# Altium schematic sheet BoardA-LEDDriver.SchDoc
size A; SheetNumber: 3; SheetTotal: 3
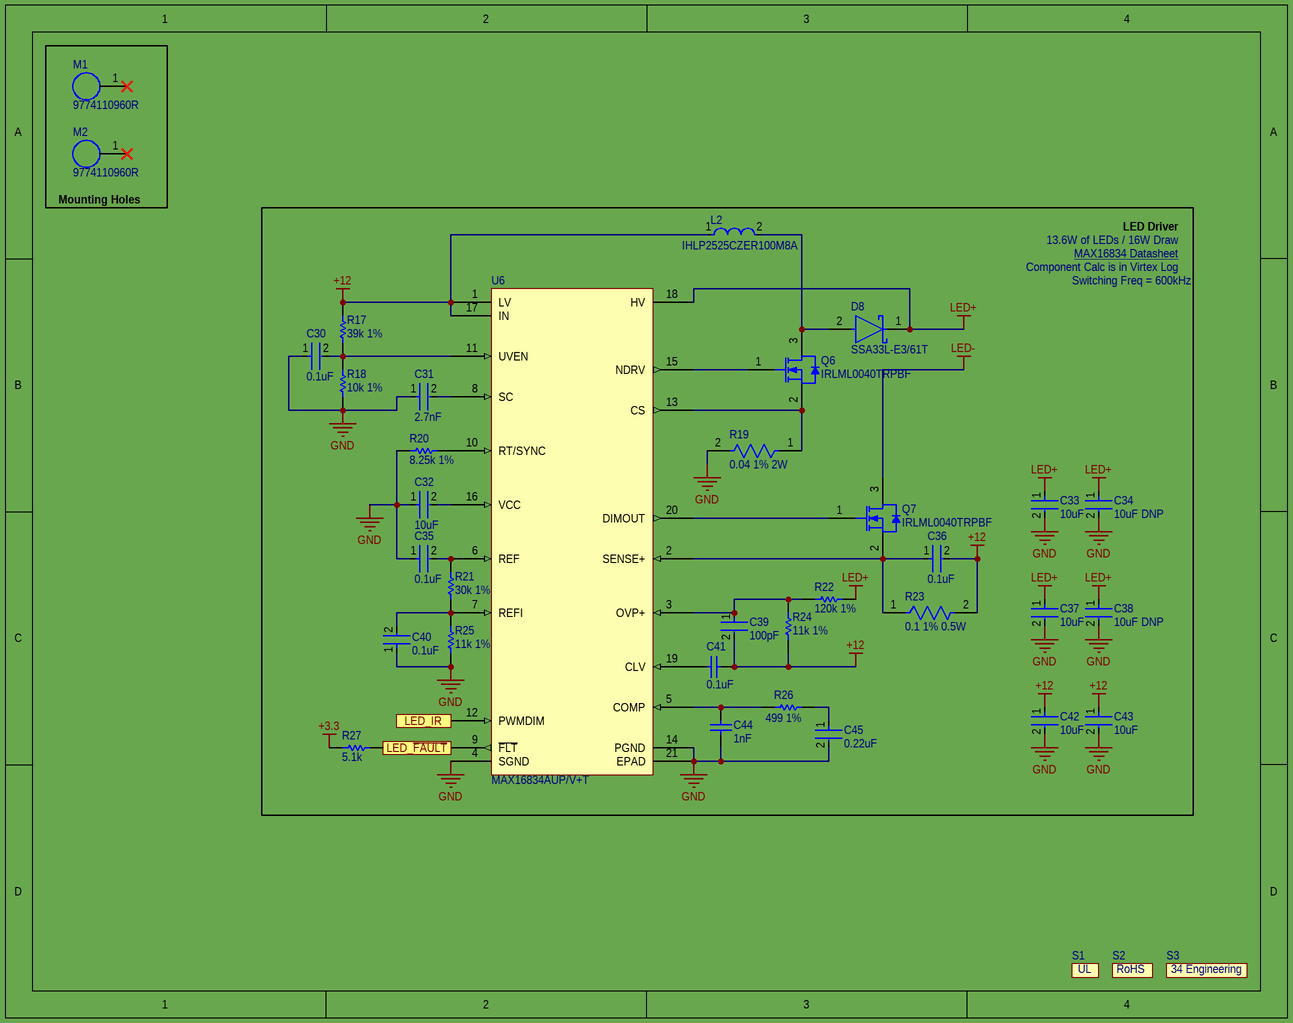
[diagram p0: BoardA-LEDDriver.SchDoc]

## Parts
C30  0.1uF  [FP-CGA3E-0_3-0_1-IPC_A]
C31  2.7nF  [FP-GCM188-0_1-MFG]
C32  10uF  [FP-GRM188-0_2-IPC_C]
C33  10uF  [FP-GRM188-0_2-IPC_C]
C34  10uF DNP  [FP-GRM188-0_2-IPC_C]
C35  0.1uF  [FP-CGA3E-0_3-0_1-IPC_A]
C36  0.1uF  [FP-CGA3E-0_3-0_1-IPC_A]
C37  10uF  [FP-GRM188-0_2-IPC_C]
C38  10uF DNP  [FP-GRM188-0_2-IPC_C]
C39  100pF  [FP-C0402-BB-MFG]
C40  0.1uF  [FP-CGA3E-0_3-0_1-IPC_A]
C41  0.1uF  [CAPC2013X135X45LL10T25]
C42  10uF  [FP-GRM188-0_2-IPC_C]
C43  10uF  [FP-GRM188-0_2-IPC_C]
C44  1nF  [CAPC1608X90X35NL10T15]
C45  0.22uF  [FP-GRM188-0_1-e0_2_0_5-IPC_C]
D8  SSA33L-E3/61T  [FP-SSA33L-E3-61T-MFG]
L2  IHLP2525CZER100M8A  [FP-IHLP-2525CZ-FP_2_413x3-MFG]
M1  9774110960R  [9774110960R]
M2  9774110960R  [9774110960R]
Q6  IRLML0040TRPBF  [INTR-SOT23-3_V]
Q7  IRLML0040TRPBF  [INTR-SOT23-3_V]
R17  39k 1%  [RESC1608X55X30NL15T15]
R18  10k 1%  [RESC1609X55X30LL15T15]
R19  0.04 1% 2W  [FP-CSRN2512-IPC_C]
R20  8.25k 1%  [RESC1608X55X30LL15T15]
R21  30k 1%  [RESC1608X55X30NL15T15]
R22  120k 1%  [RESC1609X55X30LL15T15]
R23  0.1 1% 0.5W  [FP-CSR1206-IPC_C]
R24  11k 1%  [RESC1608X55X30LL15T15]
R25  11k 1%  [RESC1608X55X30LL15T15]
R26  499 1%  [RESC1608X55X30NL15T15]
R27  5.1k  [RESC1005X40X25NL05T10]
S1  (no value)  [UL]
S2  (no value)  [RoHS]
S3  (no value)  [34EngineeringLogo]
U6  MAX16834AUP/V+T  [MAX16834AUPV+T]

## Blocks framed on the sheet
Mounting Holes: M1 M2

## Ports
LED_IR (in), LED_~{FAULT} (out)

## Nets
+3.3: R27.1
+12: C36.2 C39.2 C41.2 C42.1 C43.1 L2.1 R17.2 R23.2 R24.1 U6.1(LV) U6.17(IN)
GND: C30.1 C31.1 C32.1 C33.2 C34.2 C35.1 C37.2 C38.2 C40.1 C42.2 C43.2 C44.1 C45.2 R18.1 R19.2 R20.1 R25.2 U6.4(SGND) U6.14(PGND) U6.21(EPAD)
LED+: C33.1 C34.1 C37.1 C38.1 D8.1(C) R22.2 U6.18(HV)
LED-: Q7.3(D)
LED_~{FAULT}: R27.2 U6.9(~{FLT}) ; port LED_~{FAULT}
LED_IR: U6.12(PWMDIM) ; port LED_IR
NetC30_2: C30.2 R17.1 R18.2 U6.11(UVEN)
NetC31_2: C31.2 U6.8(SC)
NetC32_2: C32.2 U6.16(VCC)
NetC35_2: C35.2 R21.2 U6.6(REF)
NetC36_1: C36.1 Q7.2(S) R23.1 U6.2(SENSE+)
NetC39_1: C39.1 R22.1 R24.2 U6.3(OVP+)
NetC40_2: C40.2 R21.1 R25.1 U6.7(REFI)
NetC41_1: C41.1 U6.19(CLV)
NetC44_2: C44.2 R26.1 U6.5(COMP)
NetC45_1: C45.1 R26.2
NetD8_2: D8.2(A) L2.2 Q6.3(D)
NetQ6_1: Q6.1(G) U6.15(NDRV)
NetQ6_2: Q6.2(S) R19.1 U6.13(CS)
NetQ7_1: Q7.1(G) U6.20(DIMOUT)
NetR20_2: R20.2 U6.10(RT/SYNC)

Not connected (* = marked no-connect by the designer): M1 1*; M2 1*

## Notes on the sheet
- LED Driver
- Switching Freq = 600kHz
- 13.6W of LEDs / 16W Draw
- MAX16834 Datasheet <https://datasheets.maximintegrated.com/en/ds/MAX16834.pdf>
- Component Calc is in Virtex Log
- (in symbol 34EngineeringLogo) 34 Engineering

## Library data of the parts
C30 C35 C36 C40 = CMP-2000-07546-2: Cap Ceramic 100nF 50V X7R 10% Pad SMD 0603 +125°C Automotive T/R; Weight: 7.1E-05oz; Composition: Ceramic; Max Operating Temperature: 125°C; Termination: SMD/SMT; Dielectric: X7R; Length: 1.6mm; Package Quantity: 1; REACH SVHC: No SVHC; Lead Free: Lead Free; Case Code (Metric): 1608; Min Operating Temperature: -55°C; Packaging: Tape and Reel; Tolerance: 10%; Voltage Rating: 50V; Case Code (Imperial): 0603; Capacitance: 100nF; Case/Package: 0603; Voltage Rating (DC): 50V; Depth: 0.8mm; Radiation Hardening: No; Ratings: AEC-Q200; Mount: Surface Mount; Voltage: 50V; Thickness: 0.035inch; Width: 0.8mm; Height: 0.8mm
C31 = CMP-2006-02319-2: Ceramic Capacitor for Automotive 2.7nF  ±5% 50VDC C0G 0603 Paper T/R; Voltage Rating: 50V; Length: 1.6mm; Radiation Hardening: No; Package Quantity: 4000; Ratings: AEC-Q200; Packaging: Tape and Reel; Capacitance: 2.7nF; Termination: SMD/SMT; Case Code (Metric): 1608; Case/Package: 0603; Dielectric: C0G; Tolerance: 5%; Max Operating Temperature: 125°C; Min Operating Temperature: -55°C; Mount: Surface Mount; Width: 0.031inch; Case Code (Imperial): 0603; Voltage Rating (DC): 50V; Depth: 0.8mm; Height: 0.8mm; Thickness: 0.035inch
C32-C34 C37 C38 C42 C43 = CMP-2006-02814-2: Chip Multilayer Ceramic Capacitors for General Purpose, 0603, 10uF, X5R, 15%, 20%, 16V; Width: 0.031inch; Case/Package: 0603; Mount: Surface Mount; Capacitance: 10uF; Depth: 0.8mm; REACH SVHC: No SVHC; Lead Free: Lead Free; Tolerance: 20%; Case Code (Imperial): 0603; Voltage Rating: 16V; Height: 0.8mm; Case Code (Metric): 1608; Thickness: 0.031inch; Voltage: 16V; Voltage Rating (DC): 16V; Length: 1.6mm; Max Operating Temperature: 85°C; Dielectric: X5R; Min Operating Temperature: -55°C; Packaging: Tape and Reel; Package Quantity: 4000
C39 = CMP-2008-03301-2: CAP CER 100PF 100V NP0 0402; Manufacturer: Kemet; Manufacturer Part Number: C0402C101J1GACTU; Material: Ceramic; Tolerance: 0.05; Temperature Coefficient: 15%; Temperature Characteristic: C0G; Device Class L3: Ceramic Capacitors; Category: Cap; Ipc Land Pattern Name: CAPC10050X50; Lead Free: Yes; Height: 0.55mm; Temperature Range Low: -55°C; ComponentLink2Description: Datasheet; Value: 100 pF; Temperature: -55°C to +125°C; Digikey Description: CAP CER 100PF 100V NP0 0402; Voltage Rating: 100 V; ComponentLink2URL: https://content.kemet.com/datasheets/KEM_C1002_X7R_SMD.pdf; Octopart: https://octopart.com/c0402c101j1gactu-kemet-12592160; Device Class L2: Capacitors; RoHS: TRUE; Mouser Description: Cap Ceramic 100pF 100V C0G 5% SMD 0402 125°C Paper T/R; Package: C0402-BB; Automotive: No; Device Class L1: Passive Components; Capacitance: 100 pF; Temperature Range High: +125°C
C41 = CMP-2100-03644-1: Chip Capacitor, 0.1 uF, +/- 10%, 50 V, -55 to 125 degC, 0805 (2012 Metric), RoHS, Tape and Reel; Manufacturer: Murata; Voltage: 50V; Capacitance: 100nF; Insulation Resistance: 10GR; Dielectric Material: Ceramic; Dielectric: X7R; Package Description: 2-Pin Surface Mount Device, Body 2 x 1.25 mm; Manufacturer URL: http://www.murata.com/; Case Code (Imperial): 0805; Datasheet URL: http://psearch.en.murata.com/capacitor/product/GRM21BR71H104KA01%23.pdf; Termination: SMD/SMT; Lead Free: LeadFree; Package Quantity: 1; Mount: SurfaceMount; REACH SVHC: Unknown; Thickness: 0.053inch; Height: 1.25mm; Case/Package: 0805; Voltage Rating: 50V; Width: 0.049inch; Case Code (Metric): 2012; Material: Ceramic; Min Operating Temperature: -55degC; RoHSCompliant: true; Datasheet Version: 42675.0; Voltage Rating (DC): 50V; Tolerance: 10%; Package Reference: 0805; Depth: 1.25mm; Length: 2mm; Max Operating Temperature: 125degC; Packaging: TapeandReel; Number of Pins: 2; Radiation Hardening: No
C44 = CMP-2006-02891-1: Part Number: GRM188R71H102KA01D; Manufacturer: Murata
C45 = CMP-1035-02648-3: Chip Multilayer Ceramic Capacitors for General Purpose, 0603, 0.22uF, X7R, 15%, 10%, 25V; Voltage: 50V; Capacitance: 220nF; Number of Pins: 2; Length: 1.6mm; Material: Ceramic; Depth: 0.8mm; REACH SVHC: No SVHC; Voltage Rating (DC): 25V; Tolerance: 10%; Max Operating Temperature: 125°C; Lead Free: Lead Free; Package Quantity: 1; Voltage Rating: 25V; Width: 0.8mm; Case Code (Metric): 1608; Min Operating Temperature: -55°C; Case/Package: 0603; Mount: Surface Mount; Dielectric: X7R; Height: 0.8mm; Termination: SMD/SMT; Radiation Hardening: No; Case Code (Imperial): 0603; Thickness: 0.035inch; Packaging: Tape and Reel
D8 = CMP-02539-000032-1: DIODE SCHOTTKY 30V 3A DO214AC; Manufacturer: Vishay; Standoff Height: 0mm; Peak Reverse Current: 0.5mA; Max Surge Forward Current: 75A; Max Junction Temp: +150°C; Package: DO-214AC; Forward Current: 3A; Digikey Description: DIODE SCHOTTKY 30V 3A DO214AC; Reverse Voltage: 30V; Automotive: No; Max Repetitive Reverse Voltage: 30V; Temperature: -65°C to +150°C; Device Class L3: Schottky Diodes; Device Class L2: Diodes; ComponentLink2Description: Datasheet; Mouser Description: Schottky Diodes & Rectifiers 3.0 Amp 30 Volt; Height: 2.29mm; Manufacturer Part Number: SSA33L-E3/61T; Device Class L1: Discrete Semiconductors; Lead Free: Yes; Temperature Range High: +150°C; ComponentLink2URL: http://www.vishay.com/docs/88883/ssa33l.pdf; Category: Diode; RoHS: TRUE; Temperature Range Low: -65°C; Octopart: https://octopart.com/ssa33l-e3%2F61t-vishay-39552932
L2 = CMP-02424-000640-1: Automotive Inductors, High Temperature (180 °C) Series 10uH 4A 76.9mΩ 20%; DC Resistance (DCR): 76.9mR; Self Resonant Frequency: 13.9MHz; Saturation Current: 2.9A; Shielding: Shielded; Test Frequency: 100kHz; Tolerance: 20%; Max DC Current: 4A; Mount: Surface Mount; Inductance Tolerance: 20%; Length: 0.27inch; RMS Current (Irms): 4A; Case Code (Metric): 6363; Ratings: AEC-Q200; Package Quantity: 2000; Width: 0.255inch; Height: 3mm; Max Operating Temperature: 180°C; Current Rating: 4A; Case/Package: Nonstandard; Termination: SMD/SMT; Case Code (Imperial): 2525; Height - Seated (Max): 0.118inch; Inductance: 10uH; Depth: 6.47mm; Packaging: Tape and Reel; Min Operating Temperature: -55°C
M1 M2 = 9774110960R: WURTH ELEKTRONIK         9774110960R             Spacer, SMT, Swage Round, Steel, 6x11mm; Manufacturer: Wurth Electronics; Manufacturer Part Number: 9774070960R; Plating: Tin; Threaded/Unthreaded: Unthreaded; Inside Diameter: 0.13inch; Outside Diameter: 0.236inch; RoHS: Yes; Category: Spacers, Standoffs; Stock 1: 8947; Pricing 1: 1=1.73000, 10=1.65800, 50=1.45600, 100=1.35500 (USD); Material: Steel; Length: 0.33inch; REACH SVHC: Unknown; ComponentLink1URL: http://www.mouser.com/ds/2/445/9774070960R-611130.pdf?src-supplier=Mouser; ComponentLink1Description: http://www.mouser.com/ds/2/445/9774070960R-611130.pdf?src-supplier=Mouser; ComponentLink2URL: http://www.farnell.com/datasheets/1960400.pdf?src-supplier=Farnell; ComponentLink2Description: http://www.farnell.com/datasheets/1960400.pdf?src-supplier=Farnell; ComponentLink3URL: https://media.digikey.com/pdf/Data%20Sheets/Wurth%20Electronics%20PDFs/WA-SMSx_Performance_Flyer.pdf?src-supplier=Digi-Key; ComponentLink3Description: https://media.digikey.com/pdf/Data%20Sheets/Wurth%20Electronics%20PDFs/WA-SMSx_Performance_Flyer.pdf?src-supplier=Digi-Key; ComponentLink4URL: http://www.farnell.com/datasheets/1960400.pdf?src-supplier=Newark; ComponentLink4Description: http://www.farnell.com/datasheets/1960400.pdf?src-supplier=Newark; ComponentLink5URL: http://www.farnell.com/datasheets/1960400.pdf?src-supplier=Element14; ComponentLink5Description: http://www.farnell.com/datasheets/1960400.pdf?src-supplier=Element14; Stock 2: 2072; Pricing 2: 1=2.14000, 10=2.05100, 50=1.79700, 100=1.66900 (USD); ComponentLink6URL: http://www.mouser.com/ds/2/445/9774110960R-611133.pdf?src-supplier=Mouser; ComponentLink6Description: http://www.mouser.com/ds/2/445/9774110960R-611133.pdf?src-supplier=Mouser; ComponentLink7URL: http://www.farnell.com/datasheets/1960407.pdf?src-supplier=Farnell; ComponentLink7Description: http://www.farnell.com/datasheets/1960407.pdf?src-supplier=Farnell; ComponentLink8URL: http://www.farnell.com/datasheets/1960407.pdf?src-supplier=Element14; ComponentLink8Description: http://www.farnell.com/datasheets/1960407.pdf?src-supplier=Element14; Supplier 1: Digi-Key
Q6 Q7 = CMP-2000-06484-1: HEXFET(R) Power MOSFET, 40 V, -55 to 150 degC, 3-Pin SOT-23, RoHS, Tape and Reel; Manufacturer: International Rectifier; Minimum Gate Threshold Voltage: 1V; Transistor Configuration: Single; Typical Turn-Off Delay Time: 6.4ns; Maximum Gate Threshold Voltage: 2.5V; Channel Type: N; Maximum Gate Source Voltage: ±16V; Channel Mode: Enhancement; Number of Elements per Chip: 1; Maximum Continuous Drain Current: 3.6A; Typical Turn-On Delay Time: 5.1ns; Transistor Material: Si; Typical Input Capacitance @ Vds: 266pF@25V; Maximum Drain Source Resistance: 0.056Ω; Typical Gate Charge @ Vgs: 2.6nC@4.5V; Maximum Power Dissipation: 1.3W; Maximum Drain Source Voltage: 40V; Length: 3.04mm; Height: 1.02mm; Category: PowerMOSFET; Width: 1.4mm; Package Description: 3-Pin Small Outline Transistor, Body 2.92 x 1.3 mm, Pitch 0.95 mm; Pin Count: 3; Package Reference: SOT-23; Datasheet Version: 02/2012; Package Type: SOT-23; Manufacturer URL: http://internationalrectifier.com/; Mounting Technology: SurfaceMount; Dimensions: 3.04x1.4x1.02mm; Maximum Operating Temperature: +150°C; Minimum Operating Temperature: -55°C; Datasheet URL: https://datasheet.ciiva.com/22709/irlml0040pbf-22709201.pdf; Mounting Type: SurfaceMount
R17 = CMP-2000-00476-1: Part Number: ERJ3EKF3902V; Manufacturer: Panasonic
R18 = CMP-1012-00623-3: Chip Resistor, 10 KOhm, +/- 1%, 0.1 W, -55 to 155 degC, 0603 (1608 Metric), RoHS, Tape and Reel; Manufacturer: Panasonic; Voltage Rating: 75V; Case\/Package: 0603; Power Rating: 100mW; Resistance: 10KOhm; Temperature Coefficient: 100ppm\/degreesC; Number of Pins: 2; Package Reference: 603; Depth: 0.8mm; Mount: SurfaceMount; Package Description: 2-Pin Surface Mount Device, Body 1.6 x 0.85 mm; Datasheet Version: 02/2017; Length: 1.6mm; Lead Free: LeadFree; Height: 0.45mm; Number of Terminations: 2; Max Power Dissipation: 100mW; Min Operating Temperature: -55degC; Datasheet URL: https://industrial.panasonic.com/cdbs/www-data/pdf/RDA0000/AOA0000C304.pdf; Termination: SMD/SMT; Case Code (Metric): 1608; Case Code (Imperial): 0603; Tolerance: 1%; Max Operating Temperature: 155degC; RoHSCompliant: true; Voltage Rating (DC): 75V; Radiation Hardening: No; Packaging: TapeandReel; Composition: ThickFilm; Mounting Technology: SurfaceMount; Manufacturer URL: http://www.panasonic.com/; Width: 0.031inch; REACH SVHC: NoSVHC; Contact Plating: Tin; Military Standard: Not; Package Quantity: 1
R19 = CMP-26527-002019-1: Res Thick Film 2512 40mΩ 1% 2W ±200ppm/°C Molded SMD Plastic T/R; Resistance: 40mR; Length: 0.25inch; RoHS Compliant: Yes; Number of Terminations: 2; Resistor Type: Thick Film; Packaging: Tape and Reel; Case Code (Imperial): 2512; Tolerance: 1%; Max Operating Temperature: 155°C; Min Operating Temperature: -55°C; Series: CSRN; Case Code (Metric): 6432; Max Power Dissipation: 2W; Lead Free: Lead Free; Case/Package: 2512; Width: 0.124inch; Height: 0.028inch; Mount: Surface Mount; Temperature Coefficient: 200ppm/°C
R20 = CMP-2000-00659-1: Manufacturer: Panasonic; Part Number: ERJ-3EKF8251V
R21 = CMP-2000-00413-1: Part Number: ERJ-3EKF3002V; Manufacturer: Panasonic
R22 = CMP-2000-00216-2: Chip Resistor, 120 KOhm, +/- 1%, 0.1 W, -55 to 155 degC, 0603 (1608 Metric), RoHS, Tape and Reel; Manufacturer: Panasonic; Voltage Rating (DC): 75V; Temperature Coefficient: 100ppm/degC; Max Power Dissipation: 100mW; Depth: 0.8mm; Min Operating Temperature: -55degC; Number of Terminations: 2; Case Code (Metric): 1608; Datasheet Version: 42095.0; Tolerance: 1%; Radiation Hardening: No; REACH SVHC: NoSVHC; Package Description: 2-Pin Surface Mount Device, Body 1.6 x 0.85 mm; Package URL: http://www.st.com/st-web-ui/static/active/en/resource/technical/document/datasheet/CD00001320.pdf; Number of Pins: 2; Height: 0.022inch; Voltage Rating: 75V; Datasheet URL: https://industrial.panasonic.com/cdbs/www-data/pdf/RDA0000/AOA0000C283.pdf; Composition: ThickFilm; Length: 1.6mm; Width: 0.8mm; Packaging: TapeandReel; Package Reference: 0603; Package Quantity: 1; Manufacturer URL: http://www.panasonic.com/; Mount: SurfaceMount; RoHSCompliant: True; Military Standard: Not; Contact Plating: Tin; Case/Package: 0603; Max Operating Temperature: 155degC; Resistance: 120KOhm; Power Rating: 100mW; Case Code (Imperial): 0603; Termination: SMD/SMT; Lead Free: LeadFree
R23 = CMP-26527-001750-1: General Purpose Thick Film Chip Resistor, 1206, 0.1Ω, 1%, 100ppm/°C, 0.5W; Max Power Dissipation: 500mW; Resistance: 100mR; Package Quantity: 1; Series: CSR; Military Standard: Not; Case Code (Imperial): 1206; Case/Package: 1206; Temperature Coefficient: 100ppm/°C; Max Operating Temperature: 155°C; Mount: Surface Mount; Lead Free: Lead Free; Number of Terminations: 2; Construction: Rectangular; Resistor Type: Thick Film; Min Operating Temperature: -55°C; Width: 0.061inch; Length: 0.12inch; RoHS Compliant: Yes; Depth: 1.55mm; Tolerance: 1%; Packaging: Tape and Reel; Contact Plating: Tin; Height: 0.026inch; Case Code (Metric): 3216; Radiation Hardening: No
R24 R25 = CMP-2000-00199-1: Part Number: ERJ-3EKF1102V; Manufacturer: Panasonic
R26 = CMP-2000-00534-1: Manufacturer: Panasonic; Part Number: ERJ-3EKF4990V
R27 = CMP-2002-07753-1: Part Number: RC0402FR-075K1L; Manufacturer: Yageo / Phycomp
S1 = UL
S2 = RoHS
S3 = 34EngineeringLogo: 34 Engineering Silkscreen Logo
U6 = MAX16834AUP/V+T: IC LED DRVR HIGH BRIGHT 20-TSSOP; Manufacturer: Maxim; Manufacturer Part Number: MAX16834AUP+; Max Power Dissipation: 2.122W; Number of Segments: 100; Operating Supply Voltage: 28V; Number of Outputs: 1; Max Supply Current: 6mA; Topology: SEPIC; Frequency: 1MHz; Output Current: 3A; Min Input Voltage: 4.75V; Supplier 1: Digi-Key; RoHS: Yes; Category: LED Drivers; Stock 1: 756; Pricing 1: 1=6.28000, 10=5.67600, 25=5.41200, 100=4.69920, 250=4.48800, 500=4.09200, 1000=3.96000 (USD); Mount: Surface Mount; Case/Package: TSSOP; Number of Pins: 20; Contact Plating: Tin,Matte; Min Operating Temperature: -40°C; Max Operating Temperature: 125°C; Package Quantity: 74; Packaging: Rail/Tube; Power Dissipation: 2.122W; Series: -; Max Input Voltage: 28V; Switching Frequency: 1MHz; Radiation Hardening: No; RoHS Compliant: Yes; REACH SVHC: Unknown; ComponentLink1URL: https://datasheet.ciiva.com/1946/max16834-1946936.pdf?src-supplier=Digi-Key; ComponentLink1Description: https://datasheet.ciiva.com/1946/max16834-1946936.pdf?src-supplier=Digi-Key; ComponentLink2URL: https://datasheet.ciiva.com/17300/max16834-17300234.pdf?src-supplier=Avnet+Europe; ComponentLink2Description: https://datasheet.ciiva.com/17300/max16834-17300234.pdf?src-supplier=Avnet+Europe; Supplier Part Number 1: MAX16834AUP+-ND; Supplier 2: Avnet; Stock 2: 60000; Pricing 2: 2500=4.44310, 5000=4.38030, 10000=4.31750, 15000=4.25470, 20000=4.19190, 25000=4.12910, 250000=4.06630 (USD); ComponentLink3URL: https://datasheet.ciiva.com/12277/max16834-97839-12277202.pdf?src-supplier=Mouser; ComponentLink3Description: https://datasheet.ciiva.com/12277/max16834-97839-12277202.pdf?src-supplier=Mouser; ComponentLink4URL: https://datasheet.ciiva.com/3163/max16834-3163925.pdf?src-supplier=Avnet; ComponentLink4Description: https://datasheet.ciiva.com/3163/max16834-3163925.pdf?src-supplier=Avnet; ComponentLink5URL: https://datasheet.ciiva.com/1948/max16834-1948686.pdf?src-supplier=Digi-Key; ComponentLink5Description: https://datasheet.ciiva.com/1948/max16834-1948686.pdf?src-supplier=Digi-Key; Supplier Part Number 2: MAX16834AUP/V+T